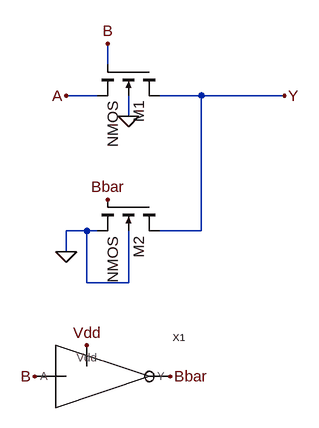
[diagram p0: schematic pass.asc]
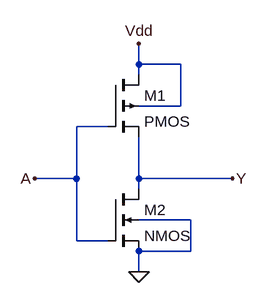
[diagram p1: sub-circuit not1.asc]
pass.asc, the LTspice schematic file:
Version 4
SHEET 1 880 680
WIRE 144 -48 144 -80
WIRE 128 0 80 0
WIRE 288 0 224 0
WIRE 416 0 288 0
WIRE 176 32 176 0
WIRE 112 208 80 208
WIRE 128 208 112 208
WIRE 288 208 288 0
WIRE 288 208 224 208
WIRE 80 240 80 208
WIRE 112 288 112 208
WIRE 176 288 176 208
WIRE 176 288 112 288
FLAG 80 240 0
FLAG 176 32 0
FLAG 80 0 A
FLAG 144 -80 B
FLAG 32 432 B
FLAG 240 432 Bbar
FLAG 112 384 Vdd
FLAG 144 160 Bbar
FLAG 416 0 Y
SYMBOL nmos4 224 -48 R90
SYMATTR InstName M1
SYMBOL nmos4 224 160 R90
SYMATTR InstName M2
SYMBOL NOT1 112 432 R0
SYMATTR InstName X1

not1.asc, the sub-circuit schematic file:
Version 4
SHEET 1 880 680
WIRE 224 16 224 -16
WIRE 288 16 224 16
WIRE 224 32 224 16
WIRE 288 80 288 16
WIRE 288 80 224 80
WIRE 176 112 128 112
WIRE 128 192 128 112
WIRE 128 192 64 192
WIRE 224 192 224 128
WIRE 368 192 224 192
WIRE 224 208 224 192
WIRE 304 256 224 256
WIRE 128 288 128 192
WIRE 176 288 128 288
WIRE 304 304 304 256
WIRE 304 304 224 304
WIRE 224 336 224 304
FLAG 224 336 0
FLAG 224 -16 Vdd
FLAG 64 192 A
FLAG 368 192 Y
SYMBOL pmos4 176 32 R0
SYMATTR InstName M1
SYMBOL nmos4 176 208 R0
SYMATTR InstName M2

The netlist it stands for:
* pass.asc
M1 Y B A 0 NMOS
M2 Y Bbar 0 0 NMOS
XX1 B Bbar Vdd not1

* block symbol definitions
.subckt not1 A Y Vdd
M1 Vdd A Y Vdd PMOS
M2 Y A 0 0 NMOS
.ends not1

.model NMOS NMOS
.model PMOS PMOS
.lib standard.mos
.backanno
.end